# Altium schematic sheet BatteryBoard.SchDoc
size B; SheetNumber: 1; SheetTotal: 1
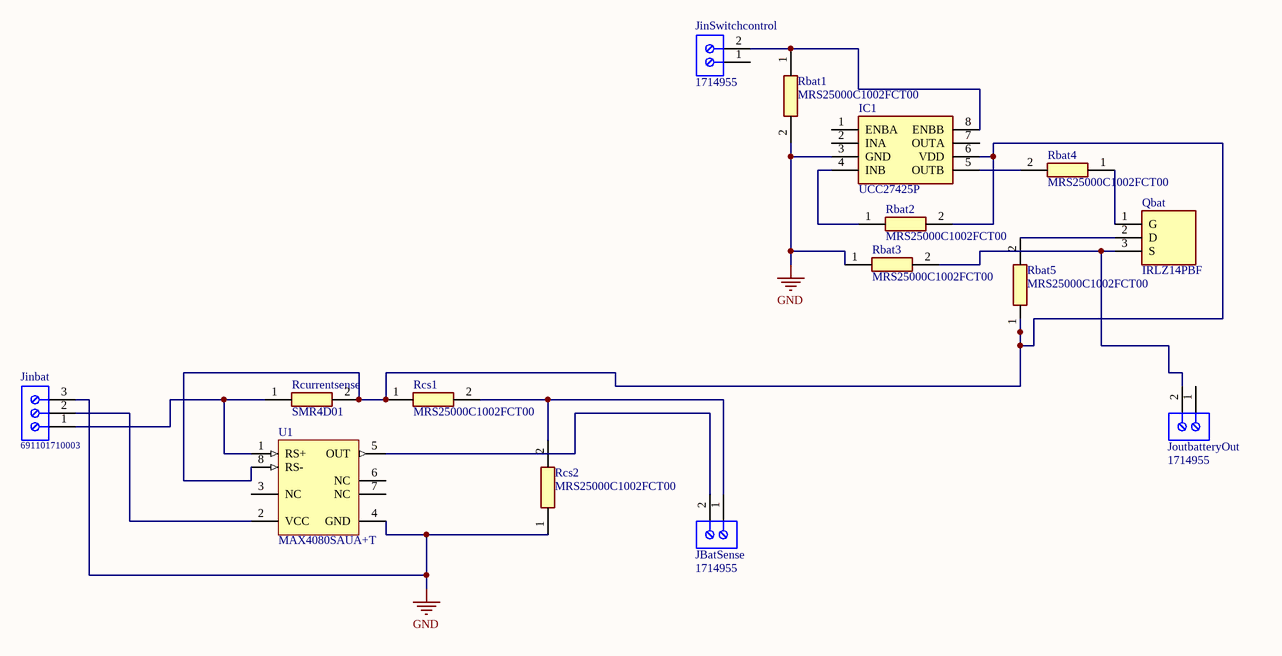
[diagram p0: BatteryBoard.SchDoc]

## Parts
IC1  UCC27425P  [DIP794W53P254L959H508Q8N]
JBatSense  1714955  [PHOE-1714955_V]
Jinbat  691101710003  [691101710003]
JinSwitchcontrol  1714955  [PHOE-1714955_V]
JoutbatteryOut  1714955  [PHOE-1714955_V]
Qbat  IRLZ14PBF  [TO254P465X1031X1954-3P]
Rbat1  MRS25000C1002FCT00  [RESAD1650W60L650D250]
Rbat2  MRS25000C1002FCT00  [RESAD1650W60L650D250]
Rbat3  MRS25000C1002FCT00  [RESAD1650W60L650D250]
Rbat4  MRS25000C1002FCT00  [RESAD1650W60L650D250]
Rbat5  MRS25000C1002FCT00  [RESAD1650W60L650D250]
Rcs1  MRS25000C1002FCT00  [RESAD1650W60L650D250]
Rcs2  MRS25000C1002FCT00  [RESAD1650W60L650D250]
Rcurrentsense  SMR4D01  [SMR4D01]
U1  MAX4080SAUA+T  [MAXM-U8+1_L]

## Nets
GND: IC1.3(GND) Jinbat.3 Rbat1.2 Rbat3.1 Rcs2.1 U1.4(GND)
NetIC1_4: IC1.4(INB) Rbat2.1
NetIC1_5: IC1.5(OUTB) Rbat4.2
NetIC1_6: IC1.6(VDD) Rbat2.2 Rbat5.1 Rcs1.1 Rcurrentsense.2 U1.8(RS-)
NetIC1_8: IC1.8(ENBB) JinSwitchcontrol.2 Rbat1.1
NetJBatSense_1: JBatSense.1 Rcs1.2 Rcs2.2
NetJBatSense_2: JBatSense.2 U1.5(OUT)
NetJinbat_1: Jinbat.1 Rcurrentsense.1 U1.1(RS+)
NetJinbat_2: Jinbat.2 U1.2(VCC)
NetJoutbatteryOut_2: JoutbatteryOut.2 Qbat.3(S) Rbat3.2
NetQbat_1: Qbat.1(G) Rbat4.1
NetQbat_2: Qbat.2(D) Rbat5.2

Not connected (* = marked no-connect by the designer): IC1 1(ENBA) 2(INA) 7(OUTA); JinSwitchcontrol 1; JoutbatteryOut 1; U1 3(NC) 6(NC) 7(NC)

## Library data of the parts
IC1 = UCC27425P: Integrated Circuit; Manufacturer_Name: Texas Instruments; Datasheet Link: http://www.ti.com/lit/ds/symlink/ucc27423.pdf; Height: 5.08mm; Manufacturer_Part_Number: UCC27425P; Mouser Part Number: 595-UCC27425P; Mouser Price/Stock: https://www.mouser.co.uk/ProductDetail/Texas-Instruments/UCC27425P?qs=eJkN62t4xTVuK5uorhoIsw%3D%3D; Arrow Part Number: UCC27425P; Arrow Price/Stock: https://www.arrow.com/en/products/ucc27425p/texas-instruments?region=nac
JBatSense JinSwitchcontrol JoutbatteryOut = CMP-2000-05797-1: PC Terminal Block, Pitch 6.35 mm, 1 x 2 Position, Height 21.5 mm, Tail Lenght 5.1 mm, RoHS, Bulk; Manufacturer: Phoenix Contact; Package Description: PC Terminal Block, Pitch 6.35 mm, 1 x 2 Position, Height 21.5 mm, Tail Lenght 5.1 mm; Datasheet URL: http://media.digikey.com/pdf/Data%20Sheets/Phoenix%20Contact%20PDFs/1714955.pdf; Package Reference: 1714955; Manufacturer URL: http://www.phoenixcontact.com/; Datasheet Version: 02/2010; Mounting Technology: ThroughHole
Jinbat = CMP-1502-03257-1: Series 101 - 5.00 mm Horizontal Entry Modular with Pressure Clamp WR-TBL, 3 pin; Manufacturer: Wurth Elektronik; Pitch: 5.00mm; Pin Number: 3; Publisher: WurthElektronik; Part Number: 691101710003; Operating Temperature: -40to105degC; Package Reference: 691101710003; Packaging: Box; Manufacturer URL: http://www.we-online.de; Datasheet URL: http://katalog.we-online.de/em/datasheet/6911017100xx.pdf; Mounting Technology: THT
Qbat = IRLZ14PBF: Transistor; Manufacturer_Name: Vishay; Datasheet Link: https://datasheet.datasheetarchive.com/originals/distributors/Datasheets-DGA23/1583879.pdf; Height: 4.65mm; Manufacturer_Part_Number: IRLZ14PBF; Mouser Part Number: 844-IRLZ14PBF; Mouser Price/Stock: https://www.mouser.co.uk/ProductDetail/Vishay-Semiconductors/IRLZ14PBF?qs=cvaI6ThkwxuEdeJ8YmO4Qg%3D%3D; Arrow Part Number: IRLZ14PBF; Arrow Price/Stock: https://www.arrow.com/en/products/irlz14pbf/vishay?region=europe
Rbat1-Rbat5 Rcs1 Rcs2 = MRS25000C1002FCT00: Resistor; Manufacturer_Name: Vishay; Datasheet Link: http://www.vishay.com/docs/28724/mrs16m25.pdf; Manufacturer_Part_Number: MRS25000C1002FCT00; Mouser Part Number: 594-MRS25000C1002FCT; Mouser Price/Stock: https://www.mouser.co.uk/ProductDetail/Vishay-BC-Components/MRS25000C1002FCT00?qs=H30XFsNYD%2FEwip42ZXddDQ%3D%3D; Arrow Part Number: MRS25000C1002FCT00; Arrow Price/Stock: https://www.arrow.com/en/products/mrs25000c1002fct00/vishay?region=nac
Rcurrentsense = SMR4D01: Resistor; Manufacturer_Name: NTE ELECTRONICS; Datasheet Link: https://www.nteinc.com/resistor_web/pdf/surface_mnt_ww.pdf; Height: 7.2mm; Manufacturer_Part_Number: SMR4D01
U1 = CMP-0252-00376-1: 76 V, High-Side, Uni-directional Current-Sense Amplifier, 60 V / V Gain, -40 to 125 degC, 8-Pin SOP (U8+1), Pb-Free, Tape and Reel; Industry Qualified: Automotive - AECQ100, Automotive - General; Gain: 5 V/V, 20 V/V ,60 V/V; Bi-Dir. Curr. Sense: No; PackageReference: U8+1; PartNumber: MAX4080SAUA+T; ComponentLink3URL: http://pdfserv.maximintegrated.com/package_dwgs/21-0036.PDF; DatasheetVersion: Rev. 4; ComponentLink2Description: Datasheet; ComponentLink3Description: Package Specification; PackageVersion: Rev. L, 08/2009; Code_JEDEC: MO-187; ComponentLink1Description: Manufacturer URL; Mounting Technology: Surface Mount; PackageDescription: 8-Pin Micro-MAX, Thin Shrink Small-Outline (U8+1), Body 3 x 3 mm, Pitch 0.65 mm; ComponentLink2URL: http://datasheets.maximintegrated.com/en/ds/MAX4080-MAX4081.pdf; ComponentLink1URL: http://www.maximintegrated.com/